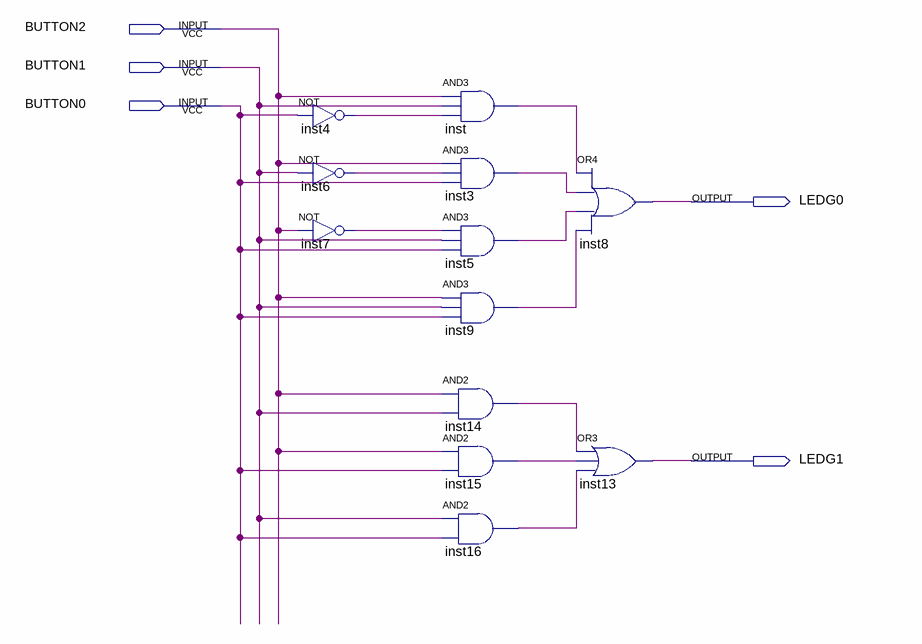
[diagram p0: schematic sheet]
// Quartus schematic lab2.bdf as structural Verilog: 12 symbols, 5 pins
module lab2 (
  input  BUTTON2,
  input  BUTTON1,
  input  BUTTON0,
  output LEDG0,
  output LEDG1
);

  wire inst3_out, inst4_out, inst5_out, inst6_out, inst7_out, inst9_out, inst14_out, inst15_out, inst16_out,
       inst_out;

  not inst4 (inst4_out, BUTTON0);
  not inst6 (inst6_out, BUTTON1);
  not inst7 (inst7_out, BUTTON2);
  and inst (inst_out, BUTTON2, BUTTON1, inst4_out);
  and inst3 (inst3_out, BUTTON2, inst6_out, BUTTON0);
  and inst5 (inst5_out, inst7_out, BUTTON1, BUTTON0);
  and inst9 (inst9_out, BUTTON2, BUTTON1, BUTTON0);
  and inst14 (inst14_out, BUTTON2, BUTTON1);
  and inst15 (inst15_out, BUTTON2, BUTTON0);
  and inst16 (inst16_out, BUTTON1, BUTTON0);
  or inst8 (LEDG0, inst_out, inst3_out, inst5_out, inst9_out);
  or inst13 (LEDG1, inst14_out, inst15_out, inst16_out);
endmodule
